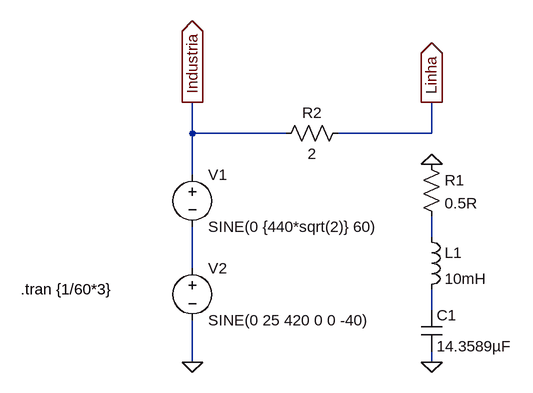
[diagram p0: schematic HF_Distorção_420Hz.asc]
HF_Distorção_420Hz.asc, the LTspice schematic file:
Version 4
SHEET 1 880 680
WIRE 16 -48 16 -96
WIRE 160 -48 16 -48
WIRE 384 -48 384 -96
WIRE 384 -48 240 -48
WIRE 16 16 16 -48
WIRE 384 112 384 80
WIRE 16 160 16 96
WIRE 384 224 384 192
WIRE 16 304 16 240
WIRE 384 304 384 288
FLAG 16 304 0
FLAG 16 -96 Industria
IOPIN 16 -96 Out
FLAG 384 304 0
FLAG 384 -96 Linha
IOPIN 384 -96 Out
FLAG 384 0 0
SYMBOL voltage 16 0 R0
WINDOW 123 0 0 Left 0
WINDOW 39 24 124 Left 2
SYMATTR InstName V1
SYMATTR Value SINE(0 {440*sqrt(2)} 60)
SYMBOL voltage 16 144 R0
WINDOW 123 0 0 Left 0
WINDOW 39 0 0 Left 0
SYMATTR InstName V2
SYMATTR Value SINE(0 25 420 0 0 -40)
SYMBOL res 368 -16 R0
SYMATTR InstName R1
SYMATTR Value 0.5R
SYMBOL ind 368 96 R0
SYMATTR InstName L1
SYMATTR Value 10mH
SYMBOL cap 368 224 R0
SYMATTR InstName C1
SYMATTR Value 14.3589µF
SYMBOL res 256 -64 R90
WINDOW 0 0 56 VBottom 2
WINDOW 3 32 56 VTop 2
SYMATTR InstName R2
SYMATTR Value 2
TEXT -248 192 Left 2 !.tran {1/60*3}

The netlist it stands for:
* HF_Distorção_420Hz.asc
V1 Industria N002 SINE(0 {440*sqrt(2)} 60)
V2 N002 0 SINE(0 25 420 0 0 -40)
R1 0 N001 0.5R
L1 N001 N003 10mH
C1 N003 0 14.3589µF
R2 Linha Industria 2
.tran {1/60*3}
.backanno
.end